# Altium schematic sheet Sensor.SchDoc
size A4
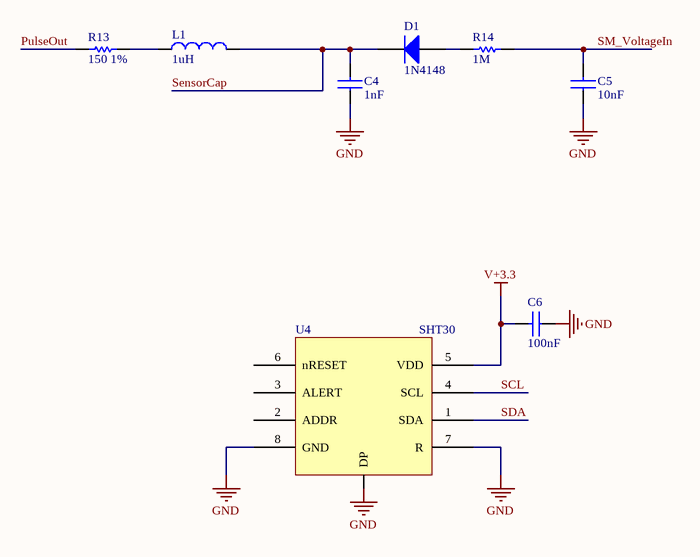
[diagram p0: Sensor.SchDoc]

## Parts
C4  1nF  [0603]
C5  10nF  [0603]
C6  100nF  [0603]
D1  1N4148  [D1810]
L1  1uH  [1210]
R13  150 1%  [0603]
R14  1M  [0603]
U4  SHT30  [QFN50P250X250X100_HS-9N]

## Nets
GND: C4.1 C5.1 C6.1 U4.0(DP) U4.7(R) U4.8(GND)
V+3.3: C6.2 U4.5(VDD)
PulseOut: R13.1
SCL: U4.4(SCL)
SDA: U4.1(SDA)
SensorCap: C4.2 D1.2(K) L1.2
SM_VoltageIn: C5.2 R14.1
NetD1_1: D1.1(A) R14.2
NetL1_1: L1.1 R13.2

Not connected (* = marked no-connect by the designer): U4 2(ADDR) 3(ALERT) 6(nRESET)

## Library data of the parts
C4-C6 = C_0402: Manufacturer: AVX; Manufacturer Part Number: 04023A101JAT2A; Supplier 1: Farnell; Supplier Part Number 1: 1327622; RoHS: YES; Stock 1: 84696; Pricing 1: 10=0,129, 100=0,099, 500=0,067, 1000=0,056, 5000=0,043 (EUR); ComponentLink1URL: http://www.avx.com/docs/Catalogs/ccog.pdf; ComponentLink1Description: http://www.avx.com/docs/Catalogs/ccog.pdf
D1 = Diode: Default Diode; Published: 8-Jun-2000; LatestRevisionDate: 17-Jul-2002; LatestRevisionNote: Re-released for DXP Platform.; PackageVersion: Sep-1996; PackageReference: SMC; Publisher: Altium Limited; PackageDescription: DO-214-AB/SMC; 2 C-Bend Leads; Body 7.9 x 5.9 mm, inc. leads (LxW); Code_JEDEC: DO-214-AB
L1 = Inductor: Code_IEC: 1005; Value: 1.5µH; Published: 8-Jun-2000; LatestRevisionDate: 29-May-2009; LatestRevisionNote: IPC-7351 Footprint Added.; PackageReference: 0402-A; Publisher: Altium Limited; PackageDescription: Chip Inductor; Code_JEITA: 0402
R13 = Res Semi: Semiconductor Resistor; Value: 1M; Published: 8-Jun-2000; LatestRevisionDate: 17-Jul-2002; LatestRevisionNote: Re-released for DXP Platform.; PackageReference: AXIAL-0.5; Publisher: Altium Limited
R14 = Res Semi: Semiconductor Resistor; Published: 8-Jun-2000; LatestRevisionDate: 17-Jul-2002; LatestRevisionNote: Re-released for DXP Platform.; PackageReference: AXIAL-0.5; Publisher: Altium Limited; Value: 1M
U4 = SHT3x